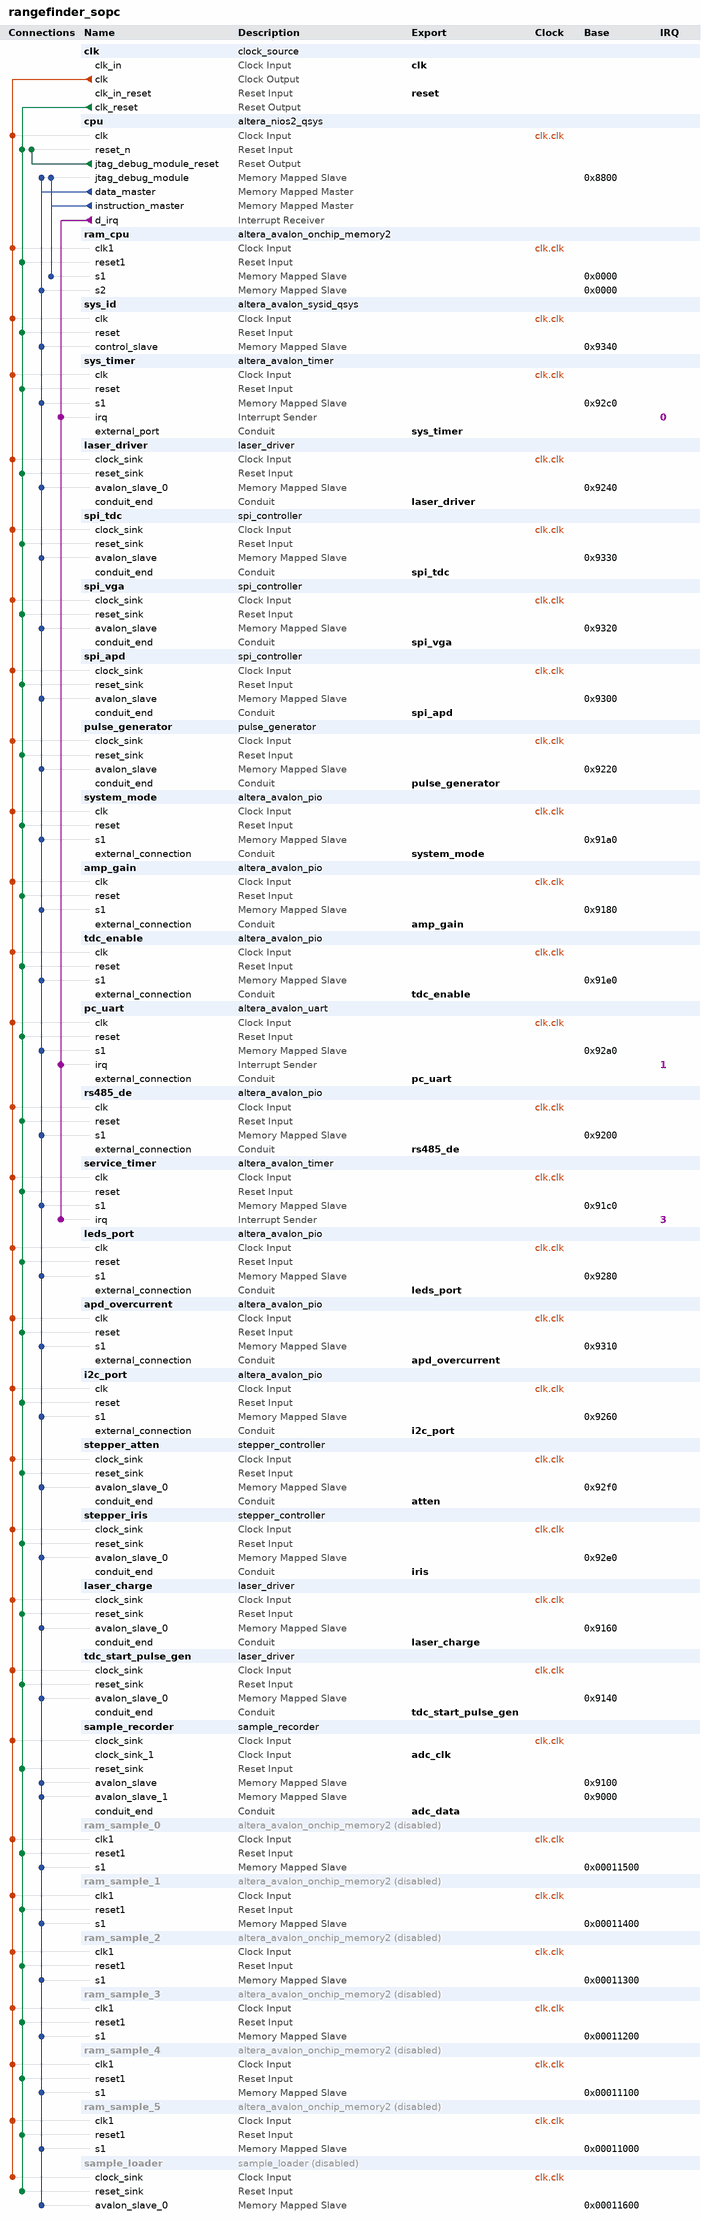
[diagram p0: system contents]
# Platform Designer (Qsys) system rangefinder_sopc, Cyclone IV E EP4CE22F17C6
# Parameters at their usual value, and those the tool derives, are not listed.
package require -exact qsys 14.0
create_system rangefinder_sopc
set_project_property DEVICE_FAMILY {Cyclone IV E}
set_project_property DEVICE EP4CE22F17C6

add_instance clk clock_source 14.0
set_instance_parameter_value clk clockFrequency 100000000

add_instance cpu altera_nios2_qsys 14.0
set_instance_parameter_value cpu resetrequest_enabled true
set_instance_parameter_value cpu resetSlave ram_cpu.s1
set_instance_parameter_value cpu mmu_TLBMissExcSlave None
set_instance_parameter_value cpu exceptionSlave ram_cpu.s1
set_instance_parameter_value cpu breakSlave cpu.jtag_debug_module
set_instance_parameter_value cpu impl Fast
set_instance_parameter_value cpu icache_size 4096
set_instance_parameter_value cpu debug_level Level2
set_instance_parameter_value cpu dcache_size 4096

add_instance ram_cpu altera_avalon_onchip_memory2 14.0
set_instance_parameter_value ram_cpu dataWidth 32
set_instance_parameter_value ram_cpu dualPort true
set_instance_parameter_value ram_cpu initMemContent true
set_instance_parameter_value ram_cpu initializationFileName onchip_mem.hex
set_instance_parameter_value ram_cpu memorySize 32768
set_instance_parameter_value ram_cpu singleClockOperation true

add_instance sys_id altera_avalon_sysid_qsys 14.0
set_instance_parameter_value sys_id id 320043385

add_instance sys_timer altera_avalon_timer 14.0
set_instance_parameter_value sys_timer period 1
set_instance_parameter_value sys_timer periodUnits MSEC
set_instance_parameter_value sys_timer timeoutPulseOutput true

add_instance laser_driver laser_driver 1.0

add_instance spi_tdc spi_controller 1.0

add_instance spi_vga spi_controller 1.0

add_instance spi_apd spi_controller 1.0

add_instance pulse_generator pulse_generator 1.0

add_instance system_mode altera_avalon_pio 14.0
set_instance_parameter_value system_mode bitModifyingOutReg true
set_instance_parameter_value system_mode direction Output
set_instance_parameter_value system_mode width 1

add_instance amp_gain altera_avalon_pio 14.0
set_instance_parameter_value amp_gain bitModifyingOutReg true
set_instance_parameter_value amp_gain direction Output
set_instance_parameter_value amp_gain width 1

add_instance tdc_enable altera_avalon_pio 14.0
set_instance_parameter_value tdc_enable bitModifyingOutReg true
set_instance_parameter_value tdc_enable direction Output
set_instance_parameter_value tdc_enable width 1

add_instance pc_uart altera_avalon_uart 14.0
set_instance_parameter_value pc_uart baud 115200
set_instance_parameter_value pc_uart dataBits 8
set_instance_parameter_value pc_uart fixedBaud true
set_instance_parameter_value pc_uart parity NONE
set_instance_parameter_value pc_uart stopBits 1

add_instance rs485_de altera_avalon_pio 14.0
set_instance_parameter_value rs485_de bitModifyingOutReg true
set_instance_parameter_value rs485_de direction Output
set_instance_parameter_value rs485_de width 1

add_instance service_timer altera_avalon_timer 14.0
set_instance_parameter_value service_timer period 100
set_instance_parameter_value service_timer periodUnits USEC

add_instance leds_port altera_avalon_pio 14.0
set_instance_parameter_value leds_port bitModifyingOutReg true
set_instance_parameter_value leds_port direction Output
set_instance_parameter_value leds_port width 8

add_instance apd_overcurrent altera_avalon_pio 14.0
set_instance_parameter_value apd_overcurrent direction Input
set_instance_parameter_value apd_overcurrent width 1

add_instance i2c_port altera_avalon_pio 14.0
set_instance_parameter_value i2c_port bitModifyingOutReg true
set_instance_parameter_value i2c_port direction Bidir
set_instance_parameter_value i2c_port width 2

add_instance stepper_atten stepper_controller 2.0

add_instance stepper_iris stepper_controller 2.0

add_instance laser_charge laser_driver 1.0

add_instance tdc_start_pulse_gen laser_driver 1.0

add_instance sample_recorder sample_recorder 1.0

add_instance ram_sample_0 altera_avalon_onchip_memory2 14.0
set_instance_property ram_sample_0 ENABLED false
set_instance_parameter_value ram_sample_0 dataWidth 8
set_instance_parameter_value ram_sample_0 dualPort true
set_instance_parameter_value ram_sample_0 initMemContent true
set_instance_parameter_value ram_sample_0 initializationFileName onchip_mem.hex
set_instance_parameter_value ram_sample_0 memorySize 256

add_instance ram_sample_1 altera_avalon_onchip_memory2 14.0
set_instance_property ram_sample_1 ENABLED false
set_instance_parameter_value ram_sample_1 dataWidth 8
set_instance_parameter_value ram_sample_1 dualPort true
set_instance_parameter_value ram_sample_1 initMemContent true
set_instance_parameter_value ram_sample_1 initializationFileName onchip_mem.hex
set_instance_parameter_value ram_sample_1 memorySize 256

add_instance ram_sample_2 altera_avalon_onchip_memory2 14.0
set_instance_property ram_sample_2 ENABLED false
set_instance_parameter_value ram_sample_2 dataWidth 8
set_instance_parameter_value ram_sample_2 dualPort true
set_instance_parameter_value ram_sample_2 initMemContent true
set_instance_parameter_value ram_sample_2 initializationFileName onchip_mem.hex
set_instance_parameter_value ram_sample_2 memorySize 256

add_instance ram_sample_3 altera_avalon_onchip_memory2 14.0
set_instance_property ram_sample_3 ENABLED false
set_instance_parameter_value ram_sample_3 dataWidth 8
set_instance_parameter_value ram_sample_3 dualPort true
set_instance_parameter_value ram_sample_3 initMemContent true
set_instance_parameter_value ram_sample_3 initializationFileName onchip_mem.hex
set_instance_parameter_value ram_sample_3 memorySize 256

add_instance ram_sample_4 altera_avalon_onchip_memory2 14.0
set_instance_property ram_sample_4 ENABLED false
set_instance_parameter_value ram_sample_4 dataWidth 8
set_instance_parameter_value ram_sample_4 dualPort true
set_instance_parameter_value ram_sample_4 initMemContent true
set_instance_parameter_value ram_sample_4 initializationFileName onchip_mem.hex
set_instance_parameter_value ram_sample_4 memorySize 256

add_instance ram_sample_5 altera_avalon_onchip_memory2 14.0
set_instance_property ram_sample_5 ENABLED false
set_instance_parameter_value ram_sample_5 dataWidth 8
set_instance_parameter_value ram_sample_5 dualPort true
set_instance_parameter_value ram_sample_5 initMemContent true
set_instance_parameter_value ram_sample_5 initializationFileName onchip_mem.hex
set_instance_parameter_value ram_sample_5 memorySize 256

add_instance sample_loader sample_loader 1.0
set_instance_property sample_loader ENABLED false

# connections
add_connection clk.clk amp_gain.clk clock
add_connection clk.clk apd_overcurrent.clk clock
add_connection clk.clk cpu.clk clock
add_connection clk.clk i2c_port.clk clock
add_connection clk.clk laser_charge.clock_sink clock
add_connection clk.clk laser_driver.clock_sink clock
add_connection clk.clk leds_port.clk clock
add_connection clk.clk pc_uart.clk clock
add_connection clk.clk pulse_generator.clock_sink clock
add_connection clk.clk ram_cpu.clk1 clock
add_connection clk.clk ram_sample_0.clk1 clock
add_connection clk.clk ram_sample_1.clk1 clock
add_connection clk.clk ram_sample_2.clk1 clock
add_connection clk.clk ram_sample_3.clk1 clock
add_connection clk.clk ram_sample_4.clk1 clock
add_connection clk.clk ram_sample_5.clk1 clock
add_connection clk.clk rs485_de.clk clock
add_connection clk.clk sample_loader.clock_sink clock
add_connection clk.clk sample_recorder.clock_sink clock
add_connection clk.clk service_timer.clk clock
add_connection clk.clk spi_apd.clock_sink clock
add_connection clk.clk spi_tdc.clock_sink clock
add_connection clk.clk spi_vga.clock_sink clock
add_connection clk.clk stepper_atten.clock_sink clock
add_connection clk.clk stepper_iris.clock_sink clock
add_connection clk.clk sys_id.clk clock
add_connection clk.clk sys_timer.clk clock
add_connection clk.clk system_mode.clk clock
add_connection clk.clk tdc_enable.clk clock
add_connection clk.clk tdc_start_pulse_gen.clock_sink clock
add_connection clk.clk_reset amp_gain.reset reset
add_connection clk.clk_reset apd_overcurrent.reset reset
add_connection clk.clk_reset cpu.reset_n reset
add_connection clk.clk_reset i2c_port.reset reset
add_connection clk.clk_reset laser_charge.reset_sink reset
add_connection clk.clk_reset laser_driver.reset_sink reset
add_connection clk.clk_reset leds_port.reset reset
add_connection clk.clk_reset pc_uart.reset reset
add_connection clk.clk_reset pulse_generator.reset_sink reset
add_connection clk.clk_reset ram_cpu.reset1 reset
add_connection clk.clk_reset ram_sample_0.reset1 reset
add_connection clk.clk_reset ram_sample_1.reset1 reset
add_connection clk.clk_reset ram_sample_2.reset1 reset
add_connection clk.clk_reset ram_sample_3.reset1 reset
add_connection clk.clk_reset ram_sample_4.reset1 reset
add_connection clk.clk_reset ram_sample_5.reset1 reset
add_connection clk.clk_reset rs485_de.reset reset
add_connection clk.clk_reset sample_loader.reset_sink reset
add_connection clk.clk_reset sample_recorder.reset_sink reset
add_connection clk.clk_reset service_timer.reset reset
add_connection clk.clk_reset spi_apd.reset_sink reset
add_connection clk.clk_reset spi_tdc.reset_sink reset
add_connection clk.clk_reset spi_vga.reset_sink reset
add_connection clk.clk_reset stepper_atten.reset_sink reset
add_connection clk.clk_reset stepper_iris.reset_sink reset
add_connection clk.clk_reset sys_id.reset reset
add_connection clk.clk_reset sys_timer.reset reset
add_connection clk.clk_reset system_mode.reset reset
add_connection clk.clk_reset tdc_enable.reset reset
add_connection clk.clk_reset tdc_start_pulse_gen.reset_sink reset
add_connection cpu.jtag_debug_module_reset cpu.reset_n reset
add_connection cpu.data_master amp_gain.s1 avalon
set_connection_parameter_value cpu.data_master/amp_gain.s1 baseAddress 0x9180
add_connection cpu.data_master apd_overcurrent.s1 avalon
set_connection_parameter_value cpu.data_master/apd_overcurrent.s1 baseAddress 0x9310
add_connection cpu.data_master cpu.jtag_debug_module avalon
set_connection_parameter_value cpu.data_master/cpu.jtag_debug_module baseAddress 0x8800
add_connection cpu.data_master i2c_port.s1 avalon
set_connection_parameter_value cpu.data_master/i2c_port.s1 baseAddress 0x9260
add_connection cpu.data_master laser_charge.avalon_slave_0 avalon
set_connection_parameter_value cpu.data_master/laser_charge.avalon_slave_0 baseAddress 0x9160
add_connection cpu.data_master laser_driver.avalon_slave_0 avalon
set_connection_parameter_value cpu.data_master/laser_driver.avalon_slave_0 baseAddress 0x9240
add_connection cpu.data_master leds_port.s1 avalon
set_connection_parameter_value cpu.data_master/leds_port.s1 baseAddress 0x9280
add_connection cpu.data_master pc_uart.s1 avalon
set_connection_parameter_value cpu.data_master/pc_uart.s1 baseAddress 0x92a0
add_connection cpu.data_master pulse_generator.avalon_slave avalon
set_connection_parameter_value cpu.data_master/pulse_generator.avalon_slave baseAddress 0x9220
add_connection cpu.data_master ram_cpu.s2 avalon
set_connection_parameter_value cpu.data_master/ram_cpu.s2 baseAddress 0x0000
add_connection cpu.data_master ram_sample_0.s1 avalon
set_connection_parameter_value cpu.data_master/ram_sample_0.s1 baseAddress 0x00011500
add_connection cpu.data_master ram_sample_1.s1 avalon
set_connection_parameter_value cpu.data_master/ram_sample_1.s1 baseAddress 0x00011400
add_connection cpu.data_master ram_sample_2.s1 avalon
set_connection_parameter_value cpu.data_master/ram_sample_2.s1 baseAddress 0x00011300
add_connection cpu.data_master ram_sample_3.s1 avalon
set_connection_parameter_value cpu.data_master/ram_sample_3.s1 baseAddress 0x00011200
add_connection cpu.data_master ram_sample_4.s1 avalon
set_connection_parameter_value cpu.data_master/ram_sample_4.s1 baseAddress 0x00011100
add_connection cpu.data_master ram_sample_5.s1 avalon
set_connection_parameter_value cpu.data_master/ram_sample_5.s1 baseAddress 0x00011000
add_connection cpu.data_master rs485_de.s1 avalon
set_connection_parameter_value cpu.data_master/rs485_de.s1 baseAddress 0x9200
add_connection cpu.data_master sample_loader.avalon_slave_0 avalon
set_connection_parameter_value cpu.data_master/sample_loader.avalon_slave_0 baseAddress 0x00011600
add_connection cpu.data_master sample_recorder.avalon_slave avalon
set_connection_parameter_value cpu.data_master/sample_recorder.avalon_slave baseAddress 0x9100
add_connection cpu.data_master sample_recorder.avalon_slave_1 avalon
set_connection_parameter_value cpu.data_master/sample_recorder.avalon_slave_1 baseAddress 0x9000
add_connection cpu.data_master service_timer.s1 avalon
set_connection_parameter_value cpu.data_master/service_timer.s1 baseAddress 0x91c0
add_connection cpu.data_master spi_apd.avalon_slave avalon
set_connection_parameter_value cpu.data_master/spi_apd.avalon_slave baseAddress 0x9300
add_connection cpu.data_master spi_tdc.avalon_slave avalon
set_connection_parameter_value cpu.data_master/spi_tdc.avalon_slave baseAddress 0x9330
add_connection cpu.data_master spi_vga.avalon_slave avalon
set_connection_parameter_value cpu.data_master/spi_vga.avalon_slave baseAddress 0x9320
add_connection cpu.data_master stepper_atten.avalon_slave_0 avalon
set_connection_parameter_value cpu.data_master/stepper_atten.avalon_slave_0 baseAddress 0x92f0
add_connection cpu.data_master stepper_iris.avalon_slave_0 avalon
set_connection_parameter_value cpu.data_master/stepper_iris.avalon_slave_0 baseAddress 0x92e0
add_connection cpu.data_master sys_id.control_slave avalon
set_connection_parameter_value cpu.data_master/sys_id.control_slave baseAddress 0x9340
add_connection cpu.data_master sys_timer.s1 avalon
set_connection_parameter_value cpu.data_master/sys_timer.s1 baseAddress 0x92c0
add_connection cpu.data_master system_mode.s1 avalon
set_connection_parameter_value cpu.data_master/system_mode.s1 baseAddress 0x91a0
add_connection cpu.data_master tdc_enable.s1 avalon
set_connection_parameter_value cpu.data_master/tdc_enable.s1 baseAddress 0x91e0
add_connection cpu.data_master tdc_start_pulse_gen.avalon_slave_0 avalon
set_connection_parameter_value cpu.data_master/tdc_start_pulse_gen.avalon_slave_0 baseAddress 0x9140
add_connection cpu.instruction_master cpu.jtag_debug_module avalon
set_connection_parameter_value cpu.instruction_master/cpu.jtag_debug_module baseAddress 0x8800
add_connection cpu.instruction_master ram_cpu.s1 avalon
set_connection_parameter_value cpu.instruction_master/ram_cpu.s1 baseAddress 0x0000
add_connection cpu.d_irq pc_uart.irq interrupt
set_connection_parameter_value cpu.d_irq/pc_uart.irq irqNumber 1
add_connection cpu.d_irq service_timer.irq interrupt
set_connection_parameter_value cpu.d_irq/service_timer.irq irqNumber 3
add_connection cpu.d_irq sys_timer.irq interrupt
set_connection_parameter_value cpu.d_irq/sys_timer.irq irqNumber 0

# exported interfaces
add_interface clk clock sink
set_interface_property clk EXPORT_OF clk.clk_in
add_interface reset reset sink
set_interface_property reset EXPORT_OF clk.clk_in_reset
add_interface sys_timer conduit end
set_interface_property sys_timer EXPORT_OF sys_timer.external_port
add_interface pc_uart conduit end
set_interface_property pc_uart EXPORT_OF pc_uart.external_connection
add_interface leds_port conduit end
set_interface_property leds_port EXPORT_OF leds_port.external_connection
add_interface i2c_port conduit end
set_interface_property i2c_port EXPORT_OF i2c_port.external_connection
add_interface laser_driver conduit end
set_interface_property laser_driver EXPORT_OF laser_driver.conduit_end
add_interface spi_tdc conduit end
set_interface_property spi_tdc EXPORT_OF spi_tdc.conduit_end
add_interface pulse_generator conduit end
set_interface_property pulse_generator EXPORT_OF pulse_generator.conduit_end
add_interface spi_vga conduit end
set_interface_property spi_vga EXPORT_OF spi_vga.conduit_end
add_interface rs485_de conduit end
set_interface_property rs485_de EXPORT_OF rs485_de.external_connection
add_interface tdc_enable conduit end
set_interface_property tdc_enable EXPORT_OF tdc_enable.external_connection
add_interface system_mode conduit end
set_interface_property system_mode EXPORT_OF system_mode.external_connection
add_interface amp_gain conduit end
set_interface_property amp_gain EXPORT_OF amp_gain.external_connection
add_interface apd_overcurrent conduit end
set_interface_property apd_overcurrent EXPORT_OF apd_overcurrent.external_connection
add_interface spi_apd conduit end
set_interface_property spi_apd EXPORT_OF spi_apd.conduit_end
add_interface iris conduit end
set_interface_property iris EXPORT_OF stepper_iris.conduit_end
add_interface atten conduit end
set_interface_property atten EXPORT_OF stepper_atten.conduit_end
add_interface laser_charge conduit end
set_interface_property laser_charge EXPORT_OF laser_charge.conduit_end
add_interface tdc_start_pulse_gen conduit end
set_interface_property tdc_start_pulse_gen EXPORT_OF tdc_start_pulse_gen.conduit_end
add_interface adc_clk clock sink
set_interface_property adc_clk EXPORT_OF sample_recorder.clock_sink_1
add_interface adc_data conduit end
set_interface_property adc_data EXPORT_OF sample_recorder.conduit_end

set_interconnect_requirement {$system} qsys_mm.clockCrossingAdapter HANDSHAKE
set_interconnect_requirement {$system} qsys_mm.maxAdditionalLatency 1
set_interconnect_requirement {$system} qsys_mm.insertDefaultSlave FALSE

save_system rangefinder_sopc.qsys
